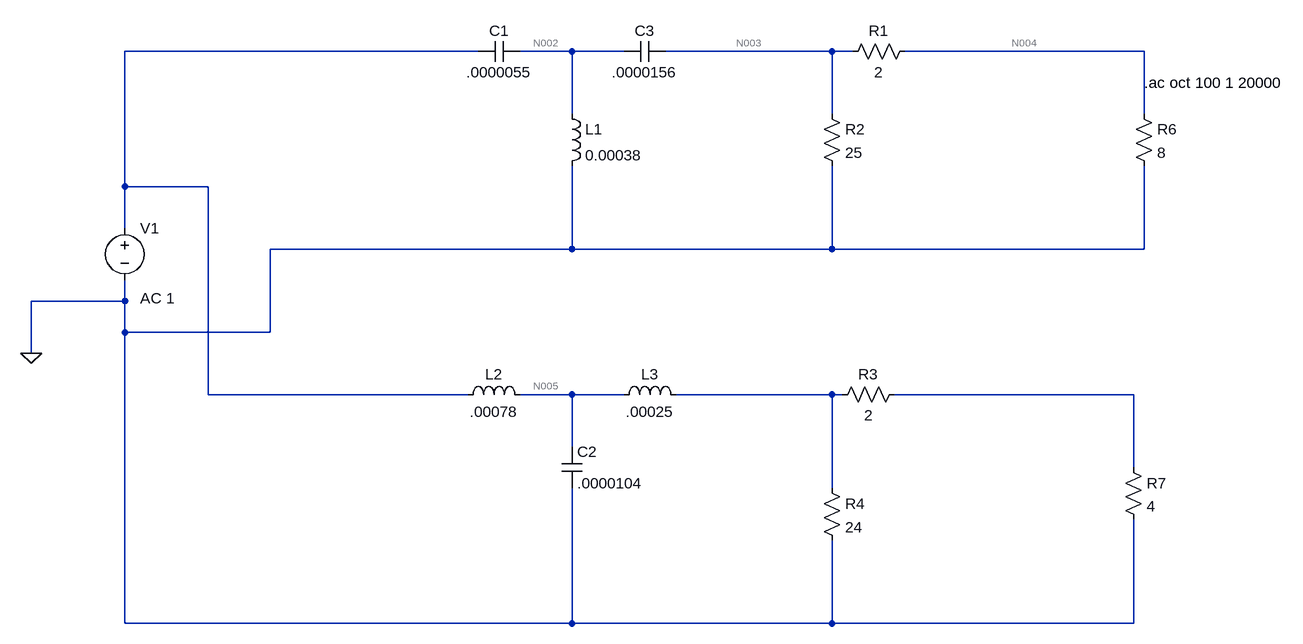
[diagram p0: schematic WithAttenuation.asc]
WithAttenuation.asc, the LTspice schematic file:
Version 4
SHEET 1 1384 1016
WIRE 144 64 -400 64
WIRE 288 64 208 64
WIRE 368 64 288 64
WIRE 688 64 432 64
WIRE 720 64 688 64
WIRE 1168 64 800 64
WIRE 288 160 288 64
WIRE 688 160 688 64
WIRE 1168 160 1168 64
WIRE -400 272 -400 64
WIRE -272 272 -400 272
WIRE -400 336 -400 272
WIRE 288 368 288 240
WIRE 288 368 -176 368
WIRE 688 368 688 240
WIRE 688 368 288 368
WIRE 1168 368 1168 240
WIRE 1168 368 688 368
WIRE -400 448 -400 416
WIRE -400 448 -544 448
WIRE -400 496 -400 448
WIRE -176 496 -176 368
WIRE -176 496 -400 496
WIRE -544 528 -544 448
WIRE -272 592 -272 272
WIRE 128 592 -272 592
WIRE 288 592 208 592
WIRE 368 592 288 592
WIRE 688 592 448 592
WIRE 704 592 688 592
WIRE 1152 592 784 592
WIRE 288 672 288 592
WIRE 1152 704 1152 592
WIRE 688 736 688 592
WIRE -400 944 -400 496
WIRE 288 944 288 736
WIRE 288 944 -400 944
WIRE 688 944 688 816
WIRE 688 944 288 944
WIRE 1152 944 1152 784
WIRE 1152 944 688 944
FLAG -544 528 0
SYMBOL cap 208 48 R90
WINDOW 0 0 32 VBottom 2
WINDOW 3 32 32 VTop 2
SYMATTR InstName C1
SYMATTR Value .0000055
SYMATTR SpiceLine V=400
SYMBOL cap 272 672 R0
SYMATTR InstName C2
SYMATTR Value .0000104
SYMATTR SpiceLine V=400
SYMBOL cap 432 48 R90
WINDOW 0 0 32 VBottom 2
WINDOW 3 32 32 VTop 2
SYMATTR InstName C3
SYMATTR Value .0000156
SYMATTR SpiceLine V=400
SYMBOL ind 272 144 R0
SYMATTR InstName L1
SYMATTR Value 0.00038
SYMATTR SpiceLine Rser=0.13
SYMBOL ind 112 608 R270
WINDOW 0 32 56 VTop 2
WINDOW 3 5 56 VBottom 2
SYMATTR InstName L2
SYMATTR Value .00078
SYMATTR SpiceLine Rser=0.20
SYMBOL ind 352 608 R270
WINDOW 0 32 56 VTop 2
WINDOW 3 5 56 VBottom 2
SYMATTR InstName L3
SYMATTR Value .00025
SYMATTR SpiceLine Rser=.10
SYMBOL res 816 48 R90
WINDOW 0 0 56 VBottom 2
WINDOW 3 32 56 VTop 2
SYMATTR InstName R1
SYMATTR Value 2
SYMATTR SpiceLine pwr=25
SYMBOL res 672 144 R0
SYMATTR InstName R2
SYMATTR Value 25
SYMATTR SpiceLine pwr=25
SYMBOL res 800 576 R90
WINDOW 0 0 56 VBottom 2
WINDOW 3 32 56 VTop 2
SYMATTR InstName R3
SYMATTR Value 2
SYMATTR SpiceLine pwr=100
SYMBOL res 672 720 R0
SYMATTR InstName R4
SYMATTR Value 24
SYMATTR SpiceLine pwr=100
SYMBOL res 1152 144 R0
SYMATTR InstName R6
SYMATTR Value 8
SYMATTR SpiceLine pwr=100
SYMBOL res 1136 688 R0
SYMATTR InstName R7
SYMATTR Value 4
SYMATTR SpiceLine pwr=400
SYMBOL voltage -400 320 R0
WINDOW 123 24 124 Left 2
WINDOW 39 0 0 Left 2
SYMATTR Value2 AC 1
SYMATTR InstName V1
SYMATTR Value ""
TEXT 1168 112 Left 2 !.ac oct 100 1 20000

The netlist it stands for:
* WithAttenuation.asc
C1 N002 N001 .0000055 V=400
C2 N005 0 .0000104 V=400
C3 N003 N002 .0000156 V=400
L1 N002 0 0.00038 Rser=0.13
L2 N001 N005 .00078 Rser=0.20
L3 N005 N006 .00025 Rser=.10
R1 N004 N003 2 pwr=25
R2 N003 0 25 pwr=25
R3 N007 N006 2 pwr=100
R4 N006 0 24 pwr=100
R6 N004 0 8 pwr=100
R7 N007 0 4 pwr=400
V1 N001 0 AC 1
.ac oct 100 1 20000
.backanno
.end

* Results of the author's LTspice run, read from the files saved beside the schematic
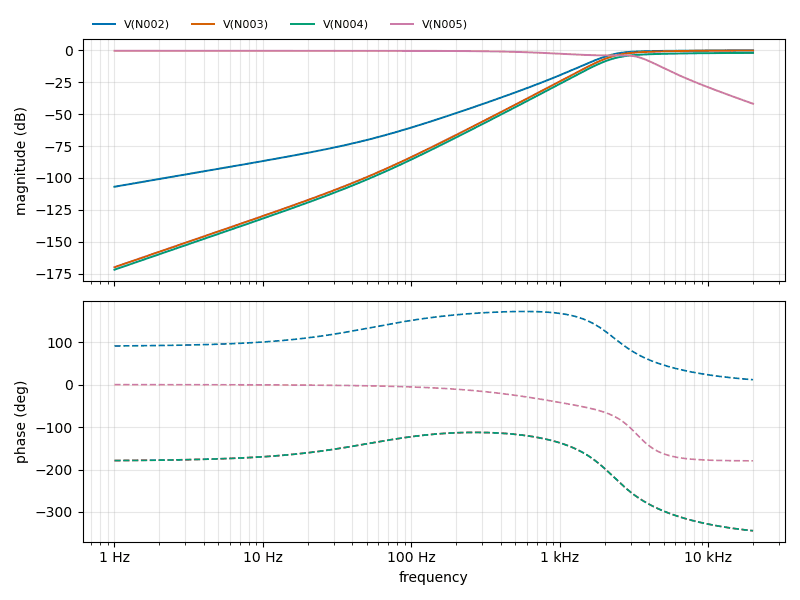
[diagram p1: AC Analysis of WithAttenuation.asc, plotted from the saved traces]
* AC Analysis, 1 run:
*   V(N002): -106.95 dB at 1 Hz, -0.04 dB at 20 kHz, peak -0.04 dB at 20 kHz, 3 dB below the peak at 2.295 kHz
*   V(N003): -170.05 dB at 1 Hz, -0.06 dB at 20 kHz, peak -0.06 dB at 20 kHz, 3 dB below the peak at 2.587 kHz
*   V(N004): -171.98 dB at 1 Hz, -2.00 dB at 20 kHz, peak -2.00 dB at 20 kHz, 3 dB below the peak at 2.587 kHz
*   V(N005): -0.35 dB at 1 Hz, -41.87 dB at 20 kHz, peak -0.35 dB at 1 Hz, 3 dB below the peak at 1.324 kHz